# Altium schematic sheet Battery.SchDoc
size A4; SheetNumber: 1; SheetTotal: 4
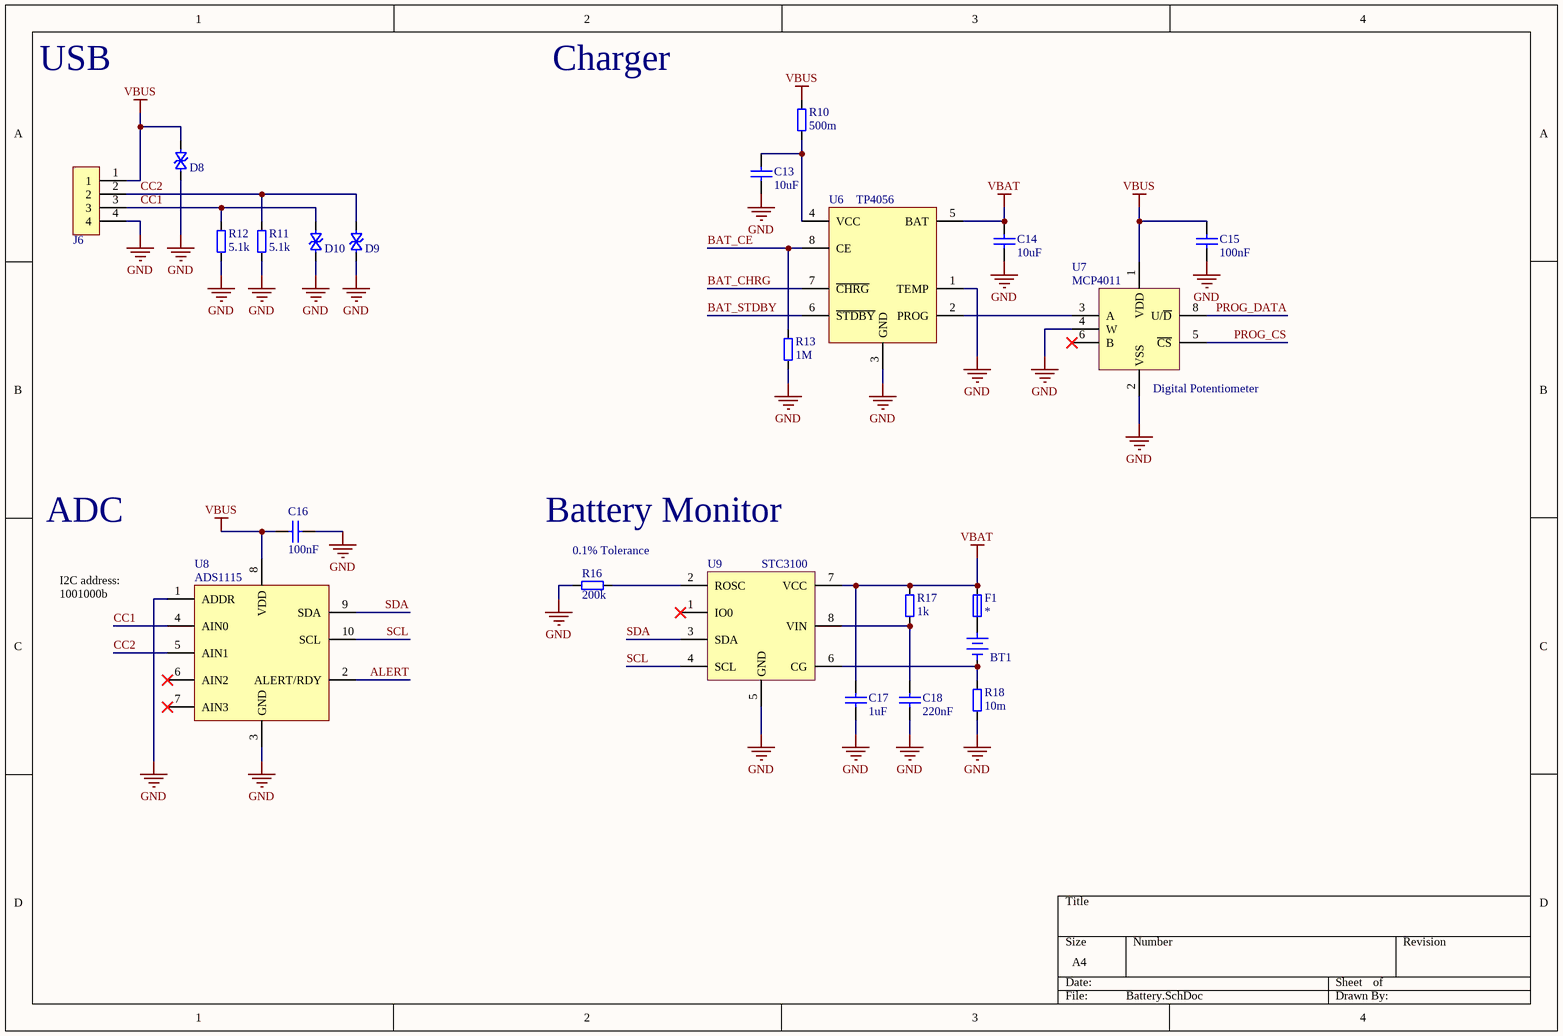
[diagram p0: Battery.SchDoc]

## Parts
BT1  18650  [1x2 Header]  (value not drawn)
C13  Capacitance: 10uF  [CAP 0805]  (hidden comment: Capacitor_10uF)
C14  Capacitance: 10uF  [CAP 0805]  (hidden comment: Capacitor_10uF)
C15  Capacitance: 100nF  [CAP 0805]  (hidden comment: Capacitor_100nF)
C16  Capacitance: 100nF  [CAP 0805]  (hidden comment: Capacitor_100nF)
C17  Capacitance: 1uF  [CAP 0805]  (hidden comment: Capacitor_1uF)
C18  Capacitance: 220nF  [CAP 0805]  (hidden comment: Capacitor_220nF)
D8  Diode_TVS_Bi  [DIOM4226X24N]  (value not drawn)
D9  Diode_TVS_Bi  [DIOM4226X24N]  (value not drawn)
D10  Diode_TVS_Bi  [DIOM4226X24N]  (value not drawn)
F1  Fuse  [RES 0805]  (value not drawn)
J6  1x4 Header  [1x4 Header]  (value not drawn)
R10  Resistance: 500m  [Axial Resistor THT]  (hidden comment: Resistor_500m)
R11  Resistance: 5.1k  [RES 0805]  (hidden comment: Resistor_5.1k)
R12  Resistance: 5.1k  [RES 0805]  (hidden comment: Resistor_5.1k)
R13  Resistance: 1M  [RES 0805]  (hidden comment: Resistor_1M)
R16  Resistance: 200k  [RES 0805]  (hidden comment: Resistor_200k)
R17  Resistance: 1k  [RES 0805]  (hidden comment: Resistor_1k)
R18  Resistance: 10m  [RES 0805]  (hidden comment: Resistor_10m)
U6  TP4056  [SOP-8N w/ Thermal Pad]
U7  MCP4011  [TSOP65P490X110-8N]
U8  ADS1115  [TSSOP50P490X110-10N]
U9  STC3100  [TSOP65P490X110-8N]

## Nets
GND: C13.1 C14.1 C15.1 C16.1 C17.2 C18.1 D8.2 D9.2 D10.2 J6.4 R11.1 R12.1 R13.1 R16.1 R18.1 U6.1(TEMP) U6.3(GND) U7.2(VSS) U7.4(W) U8.1(ADDR) U8.3(GND) U9.5(GND)
VBAT: C14.2 C17.1 F1.2 R17.2 U6.5(BAT) U9.7(VCC)
VBUS: C15.2 C16.2 D8.1 J6.1 R10.2 U7.1(VDD) U8.8(VDD)
ALERT: U8.2(ALERT/RDY)
BAT_CE: R13.2 U6.8(CE)
BAT_CHRG: U6.7(~{CHRG})
BAT_STDBY: U6.6(~{STDBY})
CC1: D10.1 J6.3 R12.2 U8.4(AIN0)
CC2: D9.1 J6.2 R11.2 U8.5(AIN1)
PROG_CS: U7.5(~{CS})
PROG_DATA: U7.8(U/~{D})
SCL: U8.10(SCL) U9.4(SCL)
SDA: U8.9(SDA) U9.3(SDA)
NetBT1_1: BT1.1 F1.1
NetBT1_2: BT1.2 R18.2 U9.6(CG)
NetC13_2: C13.2 R10.1 U6.4(VCC)
NetC18_2: C18.2 R17.1 U9.8(VIN)
NetR16_2: R16.2 U9.2(ROSC)
NetU6_2: U6.2(PROG) U7.3(A)

Not connected (* = marked no-connect by the designer): U7 6(B)*; U8 6(AIN2)* 7(AIN3)*; U9 1(IO0)*

## Notes on the sheet
- USB
- Charger
- (near U7) Digital Potentiometer
- ADC
- Battery Monitor
- (near R16) 0.1% Tolerance
- I2C address:
  1001000b

## Library data of the parts
J6 = 1x4_Header
U7 = MCP4011: Digital POT
U8 = ADS1115: 16-bit, ADC, I2C
F1 = Fuse: Trip Current: *